# EAGLE design ledB_sch (EAGLE 8.2.2)
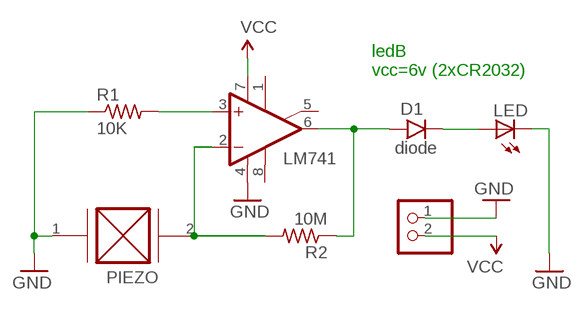
[diagram p0: schematic, sheet 1]

## Parts
D1  diode  1N4148-3  [DO35-3]
JP1  6V+  HEADER-1X2  [1X02_OVAL]
LED  LED5MM  [LED5MM]
OPAMP  LM741  LM741P  [DIL08]
PIEZO  PIEZO  [1X02_PEIZO]
R1  10K  R-US_0204/7  [0204/7]
R2  10M  R-US_0204/7  [0204/7]

## Nets
GND: JP1.1 LED.K(C) OPAMP.4(V-) PIEZO.1(GND) R1.1
N$1: OPAMP.3(+IN) R1.2
N$2: D1.A OPAMP.6(OUT) R2.1
N$5: D1.C LED.A
SIG: OPAMP.2(-IN) PIEZO.2(OUT+) R2.2
VCC: JP1.2 OPAMP.7(V+)
Unconnected: OPAMP.1(ON1) OPAMP.5(ON2) OPAMP.8(OPT)

## Notes on the sheet
- ledB
  vcc=6v (2xCR2032)

## Library data of the parts
D1 = ledB_sch:1N4148: Fast Switching Diode DO-35 glass case a.k.a. 1N914
JP1 = ledB_sch:HEADER-1X2: PIN HEADER
LED = ledB_sch:LED: LEDs Standard schematic elements and footprints for 5mm, 3mm, 1206, and 0603 sized LEDs. 5mm - Spark Fun Electronics SKU : COM-00529 (and others)
OPAMP = ledB_sch:*741: OP AMP
PIEZO = ledB_sch:PIEZO
R1 R2 = ledB_sch:R-US_: RESISTOR, American symbol

## Board
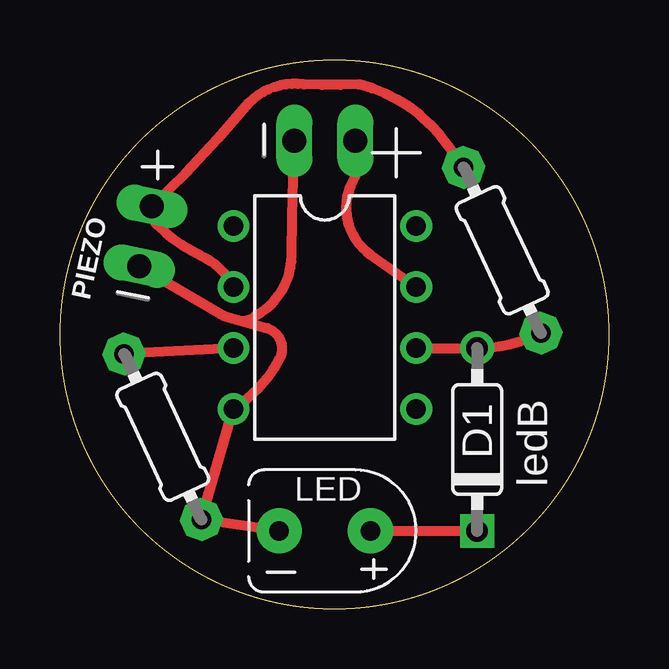
[diagram p1: board, top side]

Size 22.86 x 22.86 mm. Coordinates in mm from the lower left corner, seen from the top.
Outline: circle at 11.43,11.43 radius 11.43
Copper layers (1*16): Top 0.035mm / dielectric 1.5mm / Bottom 0.035mm
Design rules "default": minimum track width 10mil, minimum drill 24mil, track to track 8mil, track to pad 8mil, pad to pad 8mil, via to via 8mil, smd to smd 8mil, copper to edge 40mil, drill to drill 8mil, minimum pad ring 10mil, minimum via ring 8mil, stop-mask expansion 4mil, vias tented up to drill 0mil, thermal gap 10mil

### Footprints (pad centres in the part's own frame; a part is rotated, then mirrored left to right if it is on the bottom)
DO35-3 = drill 0.9: A 3.81,0 | drill 0.9 square: C -3.81,0
1X02_OVAL = drill 1 long: 1 -1.27,0; 2 1.27,0
LED5MM = drill 0.813 pad 1.88: A -1.905,0; K 1.905,0
DIL08 = drill 0.813 pad 1.27: 1 -3.81,-3.81; 2 -1.27,-3.81; 3 1.27,-3.81; 4 3.81,-3.81; 5 3.81,3.81; 6 1.27,3.81; 7 -1.27,3.81; 8 -3.81,3.81
1X02_PEIZO = drill 1 long: 1 -1.27,0; 2 1.27,0
0204/7 = drill 0.813 pad 1.676 octagon: 1 -3.81,0; 2 3.81,0

### Placement (x,y rotation side)
D1  17.38,7.05 90 top
JP1  11.03,19.49 0 top
LED  11.03,3.24 180 top
OPAMP  11.03,12.13 270 top
PIEZO  3.57,15.51 78 top
R1  4.28,7.16 115 top
R2  18.42,14.93 115 top

### Tracks (layer width: path | path; a pad name or v marks a point on that pad's centre or on a via)
GND
  Top 0.305: 6.86,12.19 arc57 8.13,12.19
  Top 0.406: PIEZO.1 6.86,12.19 8.64,11.68 arc-100 9.14,10.41 arc-29 OPAMP.4 R1.1 LED.K | 8.13,12.19 arc61 9.65,14.73 arc-1 JP1.1
N$1
  Top 0.406: OPAMP.3 R1.2
N$2
  Top 0.406: OPAMP.6 D1.A arc26 R2.1
N$5
  Top 0.406: LED.A D1.C
SIG
  Top 0.305: R2.2 16.76,18.29 | PIEZO.2 arc87 3.81,16.26
  Top 0.406: 16.76,18.29 arc51 12.45,21.84 arc-5 10.16,21.84 arc53 7.87,21.08 arc-7 PIEZO.2 | 3.81,16.26 arc24 5.84,14.73 arc-38 OPAMP.2
VCC
  Top 0.406: OPAMP.7 12.95,14.73 arc-81 12.19,17.78 arc47 JP1.2

### Text on the board
tPlace: ledB